# Altium schematic sheet MIET_464512_002_E3_Sheet_2.SchDoc
size A2
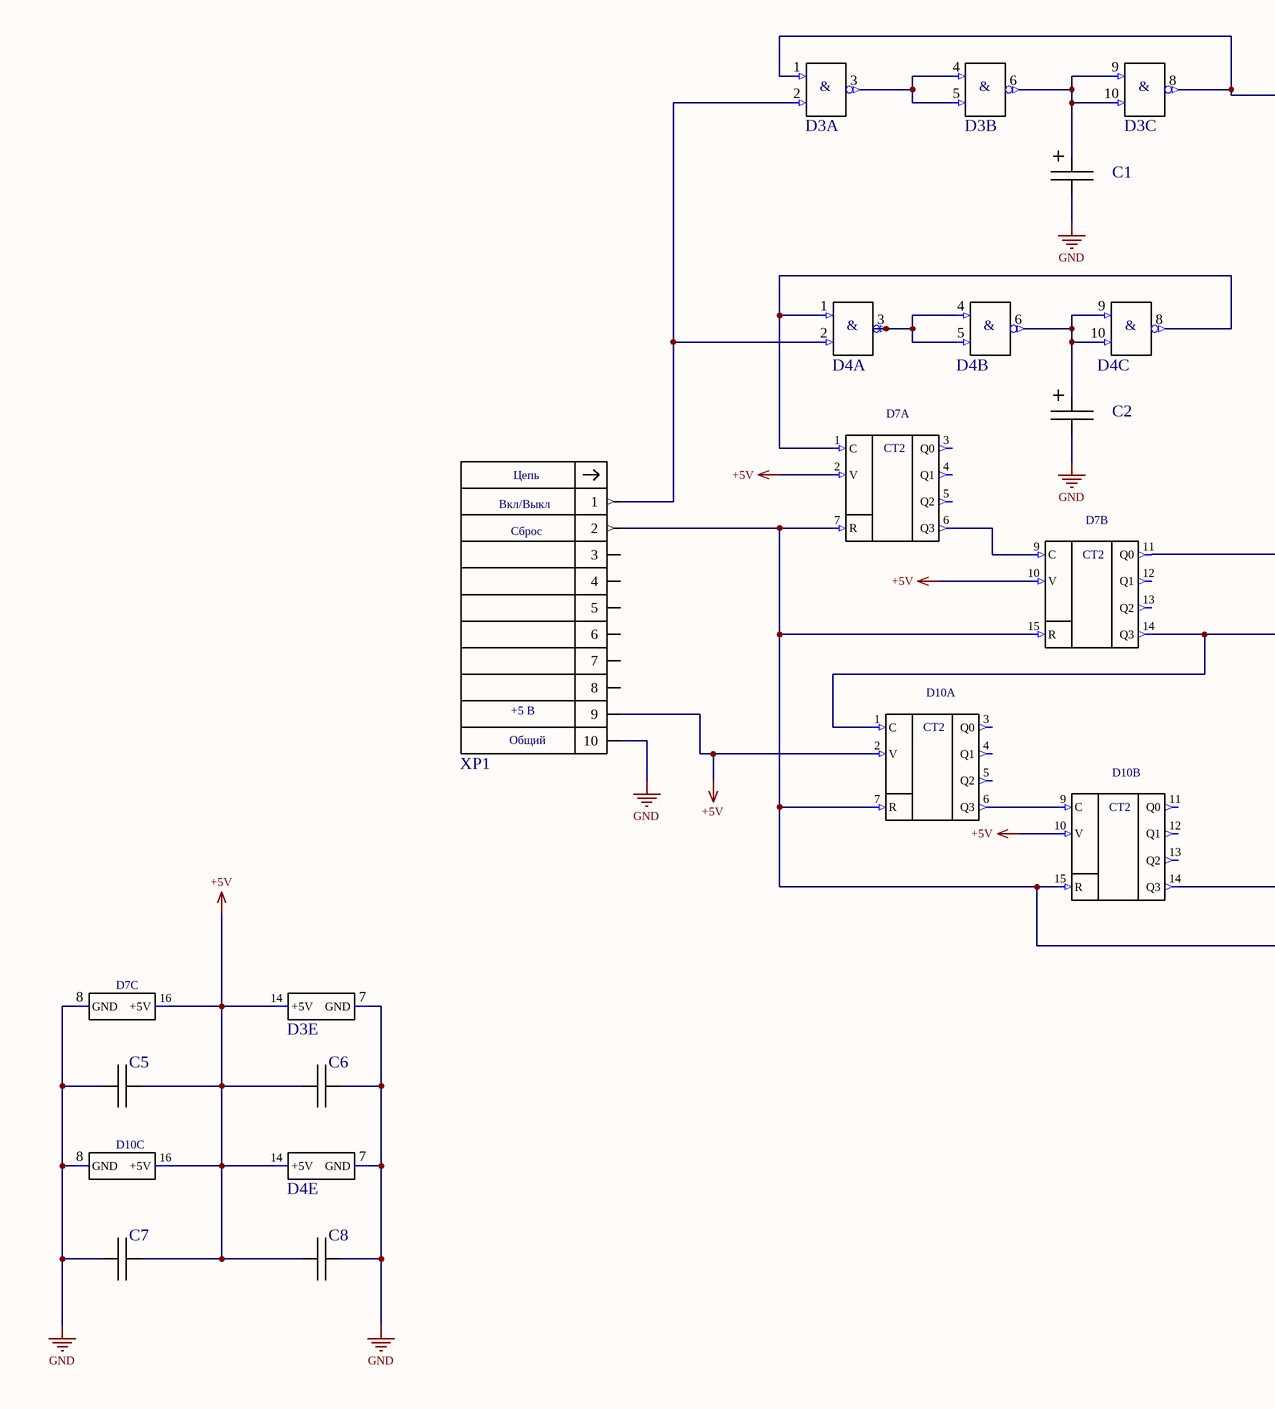
[diagram p0: MIET_464512_002_E3_Sheet_2.SchDoc, left]
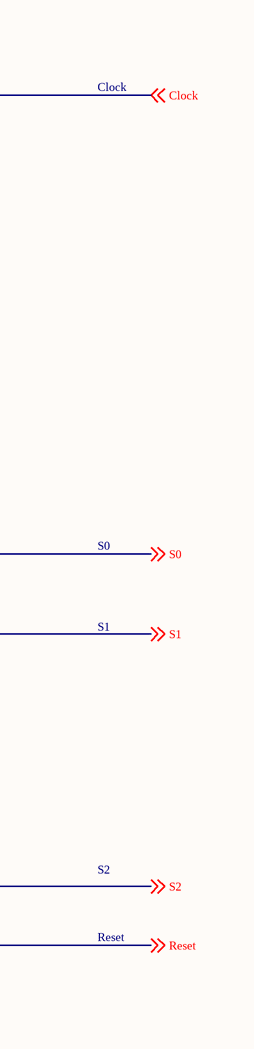
[diagram p1: MIET_464512_002_E3_Sheet_2.SchDoc, right]

## Parts
C1  C  [C-Tantal]  (value not drawn)
C2  C  [C-Tantal]  (value not drawn)
C5  (no value)  [0805_N]
C6  (no value)  [0805_N]
C7  (no value)  [0805_N]
C8  (no value)  [0805_N]
D3  74AC00PC  [DIP14]  (value not drawn)  (parts A,B,C,E of 5)
D4  74AC00PC  [DIP14]  (value not drawn)  (parts A,B,C,E of 5)
D7  MC14520BCP  [DIP16]  (value not drawn)  (parts A,B,C of 3)
D10  MC14520BCP  [DIP16]  (value not drawn)  (parts A,B,C of 3)
XP1  TE_1-1634689-0  [BH-10R]  (value not drawn)

## Nets
+5V: C5.2 C6.1 C7.2 C8.1 D3.14(+5V) D4.14(+5V) D7.2(V) D7.10(V) D7.16(+5V) D10.2(V) D10.10(V) D10.16(+5V) XP1.9
GND: C1.- C2.- C5.1 C6.2 C7.1 C8.2 D3.7(GND) D4.7(GND) D7.8(GND) D10.8(GND) XP1.10
Clock: D3.1(In1) D3.8(Out) ; off-sheet Clock
Reset: D7.7(R) D7.15(R) D10.7(R) D10.15(R) XP1.2 ; off-sheet Reset
S0: D7.11(Q0) ; off-sheet S0
S1: D7.14(Q3) D10.1(C) ; off-sheet S1
S2: D10.14(Q3) ; off-sheet S2
NetC1_+: C1.+ D3.6(Out) D3.9(In1) D3.10(In2)
NetC2_+: C2.+ D4.6(Out) D4.9(In1) D4.10(In2)
NetD3_2: D3.2(In2) D4.2(In2) XP1.1
NetD3_3: D3.3(Out) D3.4(In1) D3.5(In2)
NetD4_1: D4.1(In1) D4.8(Out) D7.1(C)
NetD4_3: D4.3(Out) D4.4(In1) D4.5(In2)
NetD7_6: D7.6(Q3) D7.9(C)
NetD10_6: D10.6(Q3) D10.9(C)

Not connected (* = marked no-connect by the designer): D7 3(Q0) 4(Q1) 5(Q2) 12(Q1) 13(Q2); D10 3(Q0) 4(Q1) 5(Q2) 11(Q0) 12(Q1) 13(Q2); XP1 3 4 5 6 7 8

## Notes on the sheet
- Clock
- Вкл/Выкл
- Сброс
- S0
- S1
- Общий
- +5 В
- S2
- Reset
- Title
- Size:
- Date:
- File:
- A2
- Number:
- Time:
- Revision:
- Sheet
- of
- (in symbol 74AC00PC, part A) &
- (in symbol 74AC00PC, part B) &
- (in symbol 74AC00PC, part C) &
- (in symbol MC14520BCP, part A) CT2
- (in symbol MC14520BCP, part B) CT2
- (in symbol TE_1-1634689-0) Цепь

## Library data of the parts
C1 C2 = K53-65_C_10%: К53-65 Конденсатор танталовый C(6032) 0,47-100 мкФ; Manufacturer: ОАО "Элеконд"; TU: АЖЯР.673546.004 ТУ; Tolerance: 10%; Created_by: Желобаев; Name: Конденсатор К53-65; BOM: Конденсатор К53-65 "C" - *B - *мкФ ±10% АЖЯР.673546.004 ТУ; Value: *; Voltage: *; Weight: 0,3; Version: 0; Issue_date: 6.01.2019; Size: C
C5-C8 = К10-79_0805_Н90: Чип конденсатор 0805 Н90 ряд Е6; Manufacturer: ООО "Кулон"; Name: Конденсатор К10-79; Tolerance: +80%-20%; TU: АЖЯР.673511.004 ТУ; Type: K10-79; BOM: Конденсатор К10-79-*-B-*+80%-20%-Н90 АЖЯР.673511.004 ТУ; Created_by: Желобаев; Version: 0; Weight: 0.05; Voltage: *; TKE: Н90; Value: *; Value_KD: *; Case: 0805; Issue_date: 19_12_2018
D3 D4 = 74AC00PC: 4 элемента 2И-НЕ TTL PDIP-14; Manufacturer: ON Semiconductor; BOM: Микросхема 74AC00PC "ON Semiconductor"; Created_by: Желобаев; Power_Voltage: 4.5 - 5.5 V; Name: Микросхема 74AC00PC; Issue_date: 10.04.2019; Case: DIP-14; Version: 0
D7 D10 = MC14520BCP: Два двоичных счетчика; Manufacturer: Motorola; Created_by: Желобаев; Name: Микросхема MC14520BCP; BOM: Микросхема MC14520BCP "Motorola"; Issue_date: 6.01.2019; Version: 0; Case: DIP-16
XP1 = TE_1-1634689-0: Вилка типа BH-10R угловая правая двухрядная 2х5х2.54; Manufacturer: TE Connectivity; Created_by: Желобаев; BOM: Вилка угловая TE_1-1634689-0 "TE Connectivity"; Name: Вилка угловая TE_1-1634689-0; Issue_date: 13.05.2019; Version: 0; Case: BH-10R